# EAGLE design sensor_glove (EAGLE 8.1.1)
CNAME: SensorGlove Schematic; CREVISION: v1.0; DESIGNER: David González Filoso
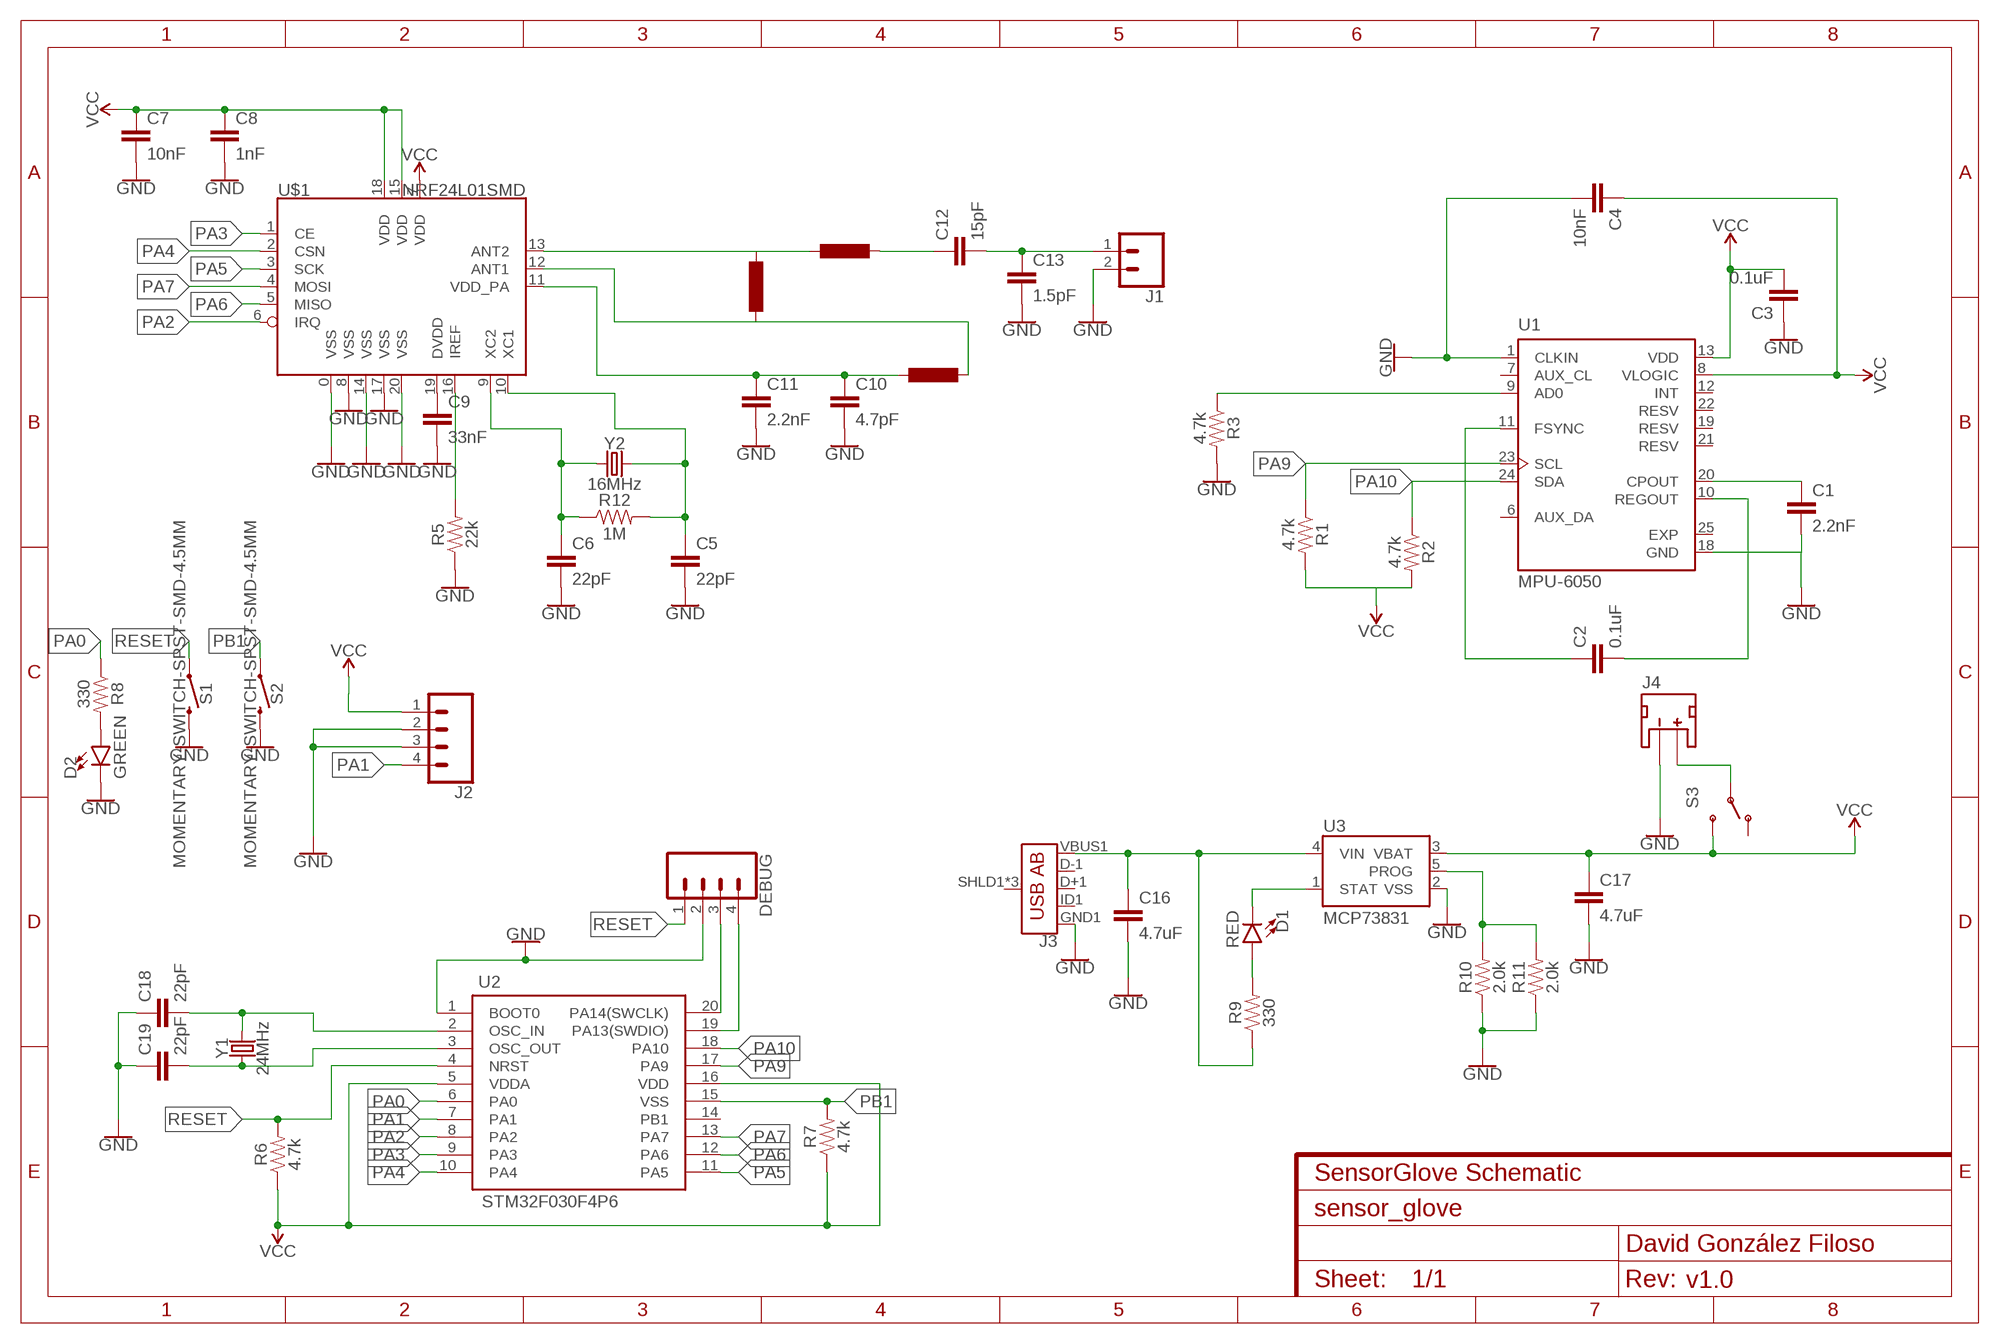
[diagram p0: schematic, sheet 1]

## Parts
C1  2.2nF  2.2NF/2200PF-0603-50V-10%  [0603]
C2  0.1uF  0.1UF-0402-16V-10%  [0402]
C3  0.1uF  0.1UF-0402-16V-10%  [0402]
C4  10nF  10NF-0603-50V-10%  [0603]
C5  22pF  22PF-0603-50V-5%  [0603]
C6  22pF  22PF-0603-50V-5%  [0603]
C7  10nF  10NF-0603-50V-10%  [0603]
C8  1nF  1.0NF/1000PF-0603-50V-10%  [0603]
C9  33nF  33NF-0603-50V-10%  [0603]
C10  4.7pF  4.7PF-0603-50V-5%  [0603]
C11  2.2nF  2.2NF/2200PF-0603-50V-10%  [0603]
C12  15pF  15PF-0402-50V-5%  [0402]
C13  1.5pF  1.5PF-0603-50V-16.667%  [0603]
C16  4.7uF  4.7UF0603  [0603]
C17  4.7uF  4.7UF0603  [0603]
C18  22pF  22PF-0603-50V-5%  [0603]
C19  22pF  22PF-0603-50V-5%  [0603]
D1  RED  LED-RED0603  [LED-0603]
D2  GREEN  LED-GREEN0603  [LED-0603]
DEBUG  CONN_04  [1X04]
J1  CONN_02  [1X02]
J2  CONN_04  [1X04]
J3  USB_AB_SMT  [USB-AB-MICRO-SMD]
J4  JST_2MM_MALE  [JST-2-SMD]
R1  4.7k  4.7KOHM-0603-1/10W-1%  [0603]
R2  4.7k  4.7KOHM-0603-1/10W-1%  [0603]
R3  4.7k  4.7KOHM-0603-1/10W-1%  [0603]
R5  22k  22KOHM-0603-1/10W-1%  [0603]
R6  4.7k  4.7KOHM-0603-1/10W-1%  [0603]
R7  4.7k  4.7KOHM-0603-1/10W-1%  [0603]
R8  330  330OHM-0603-1/10W-1%  [0603]
R9  330  330OHM-0603-1/10W-1%  [0603]
R10  2.0k  2.0KOHM-0603-1/10W-5%  [0603]
R11  2.0k  2.0KOHM-0603-1/10W-5%  [0603]
R12  1M  1MOHM-0603-1/4W-5%  [0603]
S1  MOMENTARY-SWITCH-SPST-SMD-4.5MM  [TACTILE_SWITCH_SMD_4.5MM]
S2  MOMENTARY-SWITCH-SPST-SMD-4.5MM  [TACTILE_SWITCH_SMD_4.5MM]
S3  SWITCH-SPDTSMD  [SWITCH_SPDT_SMD]
U1  MPU-6050  [QFN50P400X400X95-25N]
U2  STM32F030F4P6  [TSSOP20-STM32]
U3  MCP73831  [SOT23-5]
U$1  NRF24L01SMD  [QFN20-4X4MM]
Y1  24MHz  CRYSTAL-24MHZ"  [CRYSTAL-SMD-5X3.2-4PAD]
Y2  16MHz  CRYSTAL-16MHZPTH-HC49US  [HC49US]

## Nets
CON: J4.2(+) S3.2(P)
FSYNC: C2.1 U1.11(FSYNC)
GND: C3.1 C4.2 C5.2 C6.2 C7.2 C8.2 C9.2 C10.2 C11.2 C13.2 C16.2 C17.2 C18.1 C19.1 D2.C DEBUG.2 J1.2 J2.2 J2.3 J3.GND1(GND) J4.1(-) R3.2 R5.1 S1.1 S1.4 S2.1 S2.4 U1.1(CLKIN) U2.1(BOOT0) U$1.0(VSS) U$1.8(VSS) U$1.14(VSS) U$1.17(VSS) U$1.20(VSS)
N$1: R3.1 U1.9(AD0)
N$2: C16.1 J3.VBUS1(VBUS) R9.1 U3.4(VIN)
N$3: DEBUG.3 U2.20(PA14(SWCLK))
N$4: C6.1 R12.1 U$1.9(XC2) Y2.1
N$6: C1.1 U1.20(CPOUT)
N$7: C1.2 U1.18(GND)
N$8: C5.1 R12.2 U$1.10(XC1) Y2.2
N$9: C10.1 C11.1 U$1.11(VDD_PA)
N$10: C9.1 U$1.19(DVDD)
N$11: R5.2 U$1.16(IREF)
N$12: U$1.12(ANT1)
N$13: U$1.13(ANT2)
N$14: C12.1
N$15: C12.2 C13.1 J1.1
N$18: C18.2 U2.2(OSC_IN) Y1.3
N$19: C19.2 U2.3(OSC_OUT) Y1.1
N$20: DEBUG.4 U2.19(PA13(SWDIO))
N$22: D2.A R8.2
N$24: D1.C U3.1(STAT)
N$25: D1.A R9.2
N$27: R10.2 R11.2 U3.5(PROG)
N$28: R10.1 R11.1
N$29: U3.2(VSS)
PA0: R8.1 U2.6(PA0)
PA1: J2.4 U2.7(PA1)
PA2: U2.8(PA2) U$1.6(IRQ)
PA3: U2.9(PA3) U$1.1(CE)
PA4: U2.10(PA4) U$1.2(CSN)
PA5: U2.11(PA5) U$1.3(SCK)
PA6: U2.12(PA6) U$1.5(MISO)
PA7: U2.13(PA7) U$1.4(MOSI)
PA9: R1.1 U1.23(SCL) U2.17(PA9)
PA10: R2.1 U1.24(SDA) U2.18(PA10)
PB1: R7.2 S2.2 S2.3 U2.15(VSS)
REGOUT: C2.2 U1.10(REGOUT)
RESET: DEBUG.1 R6.2 S1.2 S1.3 U2.4(NRST)
VCC: C3.2 C4.1 C7.1 C8.1 C17.1 J2.1 R1.2 R2.2 R6.1 R7.1 S3.3(S) U1.8(VLOGIC) U1.13(VDD) U2.5(VDDA) U2.16(VDD) U3.3(VBAT) U$1.7(VDD) U$1.15(VDD) U$1.18(VDD)
Unconnected: J3.D+1(D+) J3.D-1(D-) J3.ID1(USBID) J3.SHLD1(SHIELD) J3.SHLD2(SHIELD) J3.SHLD3(SHIELD) J4.NC1(PAD1) J4.NC2(PAD2) S3.1(O) U1.6(AUX_DA) U1.7(AUX_CL) U1.12(INT) U1.19(RESV) U1.21(RESV) U1.22(RESV) U2.14(PB1)

## Power pins joined to a net without a drawn wire
EXP: U1.25(EXP)

## Library data of the parts
C1 C11 = SparkFun-Capacitors:2.2NF/2200PF: 2.2nF/2,200pF ceramic capacitors A capacitor is a passive two-terminal electrical component used to store electrical energy temporarily in an electric field.; PROD_ID: CAP-07877
C2 C3 = SparkFun-Capacitors:0.1UF: 0.1µF ceramic capacitors A capacitor is a passive two-terminal electrical component used to store electrical energy temporarily in an electric field.; PROD_ID: CAP-12416
C4 C7 = SparkFun-Capacitors:10NF: 0.01uF/10nF/10,000pF ceramic capacitors A capacitor is a passive two-terminal electrical component used to store electrical energy temporarily in an electric field. CAP-09321; PROD_ID: CAP-00867
C5 C6 C18 C19 = SparkFun-Capacitors:22PF: 22pF ceramic capacitors A capacitor is a passive two-terminal electrical component used to store electrical energy temporarily in an electric field.; PROD_ID: CAP-07876
C8 = SparkFun-Capacitors:1.0NF/1000PF: 1nF/1,000pF ceramic capacitors A capacitor is a passive two-terminal electrical component used to store electrical energy temporarily in an electric field.; PROD_ID: CAP-07886
C9 = SparkFun-Capacitors:33NF: 33nF ceramic capacitors A capacitor is a passive two-terminal electrical component used to store electrical energy temporarily in an electric field.; PROD_ID: CAP-07887
C10 = SparkFun-Capacitors:4.7PF: 4.7pF ceramic capacitors A capacitor is a passive two-terminal electrical component used to store electrical energy temporarily in an electric field.; PROD_ID: CAP-07880
C12 = SparkFun-Capacitors:15PF: 15pF ceramic capacitors A capacitor is a passive two-terminal electrical component used to store electrical energy temporarily in an electric field.; PROD_ID: CAP-13063
C13 = SparkFun-Capacitors:1.5PF: 1.5pF ceramic capacitors A capacitor is a passive two-terminal electrical component used to store electrical energy temporarily in an electric field.; PROD_ID: CAP-08763
C16 C17 = SparkFun-Capacitors:4.7UF: 4.7µF ceramic capacitors A capacitor is a passive two-terminal electrical component used to store electrical energy temporarily in an electric field.; PROD_ID: CAP-08280
D1 = SparkFun-LED:LED-RED: Red SMD LED Used in manufacturing of most products at SparkFun Packages: 0603 - SMD 0603 package [Product Link] <http://docs.avagotech.com/docs/AV02-0551EN> 0603 SMART - SMD 0603 SMART package ( more efficient and expensive)[Product Link] <http://www.osram-os.com/Graphics/XPic2/00077099_0.pdf> 1206 - SMD1206 package [Product Link] <https://www.sparkfun.com/datasheets/DevTools/LilyPad/Q150OVS4.pdff> SparkFun Products: Pro Mini 328 -5V <https://www.sparkfun.com/products/821> RedBoard <https://www.sparkfun.com/products/12757> IOIO-OTG <https://www.sparkfun.com/products/13613>; PROD_ID: DIO-00819
D2 = SparkFun-LED:LED-GREEN: Green SMD LED Used in manufacturing of various products at SparkFun Packages: 0603 - SMD 0603 package [Product Link] <http://www.futureelectronics.com/en/technologies/semiconductors/optoelectronics/leds/Pages/9894312-LTST-C190GKT.aspx?CrossPart=HSMG-C190&IM=0> LilyPad 1206 - SMD1206 LilyPad package [Product Link] <http://www.futureelectronics.com/en/Technologies/Product.aspx?ProductID=IN150NGHARVATEKCORPORATION2049943&IM=0> 1206 - SMD1206 package [Product Link] <http://www.futureelectronics.com/en/technologies/semiconductors/optoelectronics/leds/Pages/8315665-LTST-C150KGKT.aspx?IM=0> 1206 Bottom Mount -SMD 1206 Bottom Mount [Product Link] <http://www.digikey.com/product-detail/en/lite-on-inc/LTST-C230KGKT/160-1456-1-ND/386854> SparkFun Products: Pro Mini 328 -5V <https://www.sparkfun.com/products/821> RedBoard <https://www.sparkfun.com/products/12757> MP3 Trigger <https://www.sparkfun.com/products/13720> Makey Makey <https://www.sparkfun.com/products/11076>; PROD_ID: DIO-00821
DEBUG J2 = SparkFun-Connectors:CONN_04: Multi connection point. Often used as Generic Header-pin footprint for 0.1 inch spaced/style header connections On any of the 0.1 inch spaced packages, you can populate with these: Break Away Headers - Straight <https://www.sparkfun.com/products/116> (PRT-00116) Break Away Male Headers - Right Angle <https://www.sparkfun.com/products/553> (PRT-00553) Female Headers <https://www.sparkfun.com/products/115> (PRT-00115) Break Away Headers - Machine Pin <https://www.sparkfun.com/products/117> (PRT-00117) Break Away Female Headers - Swiss Machine Pin <https://www.sparkfun.com/products/743> (PRT-00743) For SCREWTERMINALS and SPRING TERMINALS visit here: Screw Terimnals on SparkFun.com <https://www.sparkfun.com/search/results?term=Screw+Terminals> (5mm/3.5mm/2.54mm spacing) This device is also useful as a general connection point to wire up your design to another part of your project. Our various solder wires solder well into these plated through hole pads. Hook-Up Wire - Assortment (Stranded, 22 AWG) <https://www.sparkfun.com/products/11375> (PRT-11375) Hook-Up Wire - Assortment (Solid Core, 22 AWG) <https://www.sparkfun.com/products/11367> (PRT-11367) View the entire wire category on our website here <https://www.sparkfun.com/categories/141> Special notes: Molex polarized connector foot print use with SKU : PRT-08231 with associated crimp pins and housings. 1MM SMD Version SKU: PRT-10208; PROD_ID: CONN-09696
J1 = SparkFun-Connectors:CONN_02: Multi connection point. Often used as Generic Header-pin footprint for 0.1 inch spaced/style header connections On any of the 0.1 inch spaced packages, you can populate with these: Break Away Headers - Straight <https://www.sparkfun.com/products/116> (PRT-00116) Break Away Male Headers - Right Angle <https://www.sparkfun.com/products/553> (PRT-00553) Female Headers <https://www.sparkfun.com/products/115> (PRT-00115) Break Away Headers - Machine Pin <https://www.sparkfun.com/products/117> (PRT-00117) Break Away Female Headers - Swiss Machine Pin <https://www.sparkfun.com/products/743> (PRT-00743) For SCREWTERMINALS and SPRING TERMINALS visit here: Screw Terimnals on SparkFun.com <https://www.sparkfun.com/search/results?term=Screw+Terminals> (5mm/3.5mm/2.54mm spacing) This device is also useful as a general connection point to wire up your design to another part of your project. Our various solder wires solder well into these plated through hole pads. Hook-Up Wire - Assortment (Stranded, 22 AWG) <https://www.sparkfun.com/products/11375> (PRT-11375) Hook-Up Wire - Assortment (Solid Core, 22 AWG) <https://www.sparkfun.com/products/11367> (PRT-11367) View the entire wire category on our website here <https://www.sparkfun.com/categories/141> Special notes: Molex polarized connector foot print use with: PRT-08233 with associated crimp pins and housings. 2.54_SCREWTERM for use with PRT-10571. 3.5mm Screw Terminal footprints for PRT-08084 5mm Screw Terminal footprints for use with PRT-08432
J3 = SparkFun-Connectors:USB_AB: USB Type AB Micro Connector OTG-compatible. 5 pins, 3 shield pins SparkFun Products: IOIO-OTG <https://www.sparkfun.com/products/13613> SparkFun SAMD21 Mini Breakout <https://www.sparkfun.com/products/13664>; PROD_ID: CONN-11794
J4 = SparkFun-Connectors:JST_2MM_MALE: JST 2MM MALE RA CONNECTOR Two pin, compact surface mount connector. Commonly used as a battery input connection point. We really like the solid locking feeling and high current rating on these small connectors. We use these all the time as battery connectors. Mates to single-cell LiPo batteries. Here is the connector we sell at SparkFun: JST Right Angle Connector - White <https://www.sparkfun.com/products/8612> (PRT-08612) Datasheet <http://www.sparkfun.com/datasheets/Prototyping/Connectors/JST-Horizontal.pdf> It was used on these SparkFun products: SparkFun MOSFET Power Controller <https://www.sparkfun.com/products/11214> (PRT-11214) SparkFun Battery Babysitter - LiPo Battery Manager <https://www.sparkfun.com/products/13777> (PRT-13777) And many, many others that required a lipo battery connection.; PROD_ID: CONN-11443; SF_ID: PRT-08612
R1-R3 R6 R7 = SparkFun-Resistors:4.7KOHM: 4.7kΩ resistor A resistor is a passive two-terminal electrical component that implements electrical resistance as a circuit element. Resistors act to reduce current flow, and, at the same time, act to lower voltage levels within circuits. - Wikipedia; PROD_ID: RES-07857
R5 = SparkFun-Resistors:22KOHM: 22kΩ resistor A resistor is a passive two-terminal electrical component that implements electrical resistance as a circuit element. Resistors act to reduce current flow, and, at the same time, act to lower voltage levels within circuits. - Wikipedia; PROD_ID: RES-07853
R8 R9 = SparkFun-Resistors:330OHM: 330Ω resistor A resistor is a passive two-terminal electrical component that implements electrical resistance as a circuit element. Resistors act to reduce current flow, and, at the same time, act to lower voltage levels within circuits. - Wikipedia; PROD_ID: RES-00818
R10 R11 = SparkFun-Resistors:2.0KOHM: 2kΩ resistor A resistor is a passive two-terminal electrical component that implements electrical resistance as a circuit element. Resistors act to reduce current flow, and, at the same time, act to lower voltage levels within circuits. - Wikipedia; PROD_ID: RES-08296
R12 = SparkFun-Resistors:1MOHM: 1MΩ resistor A resistor is a passive two-terminal electrical component that implements electrical resistance as a circuit element. Resistors act to reduce current flow, and, at the same time, act to lower voltage levels within circuits. - Wikipedia; PROD_ID: RES-07868
S1 S2 = SparkFun-Switches:MOMENTARY-SWITCH-SPST: Momentary Switch (Pushbutton) - SPST Normally-open (NO) SPST momentary switches (buttons, pushbuttons). Variants PTH-12MM - 12mm square, through-hole Momentary Pushbutton Switch - 12mm Square <https://www.sparkfun.com/products/9190> (COM-09190) PTH-6.0MM, PTH-6.0MM-KIT - 6.0mm square, through-hole Mini Pushbutton Switch <https://www.sparkfun.com/products/97> (COM-00097) KIT package intended for soldering kit's - only one side of pads' copper is exposed. PTH-RIGHT-ANGLE-KIT - Right-angle, through-hole Right Angle Tactile Button <https://www.sparkfun.com/products/10791> - Used on SparkFun BigTime Watch Kit <https://www.sparkfun.com/products/11734> SMD-12MM - 12mm square, surface-mount Tactile Button - SMD (12mm) <https://www.sparkfun.com/products/12993> (COM-12993) Used on SparkFun PicoBoard <https://www.sparkfun.com/products/11888> SMD-4.5MM - 4.5mm Square Trackball Switch Used on SparkFun Blackberry Trackballer Breakout <https://www.sparkfun.com/products/13169> SMD-4.6MMX2.8MM - 4.60mm x 2.80mm, surface mount Used on SparkFun SAMD21 Mini Breakout <https://www.sparkfun.com/products/13664> SMD-5.2MM, SMD-5.2-REDUNDANT - 5.2mm square, surface-mount Mini Pushbutton Switch - SMD <https://www.sparkfun.com/products/8720> (COM-08720) Used on Arduino Pro Mini <https://www.sparkfun.com/products/11114> REDUNDANT package connects both switch circuits together SMD-6.0X3.5MM - 6.0 x 3.5mm, surface mount Momentary Reset Switch SMD <https://www.sparkfun.com/products/8229> (COM-08229) SMD-6.2MM-TALL - 6.2mm square, surface mount Tactile Button - SMD (6mm) <https://www.sparkfun.com/products/12992> Used on SparkFun Digital Sandbox <https://www.sparkfun.com/products/12651> SMD-RIGHT-ANGLE - Right-angle, surface mount Used on SparkFun Block for Intel® Edison - Arduino <https://www.sparkfun.com/products/13036>; PROD_ID: SWCH-09213
S3 = SparkFun-Retired:SWITCH-SPDT: SPDT Switch Simple slide switch, Spark Fun Electronics SKU : COM-00102 DPDT SMT slide switch, AYZ0202, SWCH-08179
U1 = MPU-6050:MPU-6050: MPU-6050 Six-Axis (Gyro + Accelerometer) MEMS MotionTracking™ Devices; AVAILABILITY: Good; DESCRIPTION: 3-axis gyroscope, 3-axis accelerometer in a 4x4x0.9 housing; MF: InvenSense; MP: MPU-6050; PACKAGE: QFN-24 InvenSense; PRICE: 7.56 USD
U2 = STM32:STM32F030F4P6: Device for STM32F030F4P6
U3 = SparkFun-IC-Power:MCP73831: MCP73831T Li-Ion, Li-Pol Controller Miniature single cell, fully integrated Li-Ion, Li-polymer charge management controller Datasheet <http://ww1.microchip.com/downloads/en/DeviceDoc/20001984g.pdf> SparkFun Products: SparkFun ESP32 Thing <https://www.sparkfun.com/products/13907> SparkFun 9DoF Razor IMU M0 <https://www.sparkfun.com/products/14001>; PROD_ID: IC-09995
U$1 = SparkFun-RF:NRF24L01: Nordic nrf24L01 2.4GHz Low-power Transceiver This is the very popular, low cost, very low power RF transceiver from Nordic Semiconductor. Simple SPI interface. SparkFun Products 2.4GHz Transceiver IC - nRF24L01+ <https://www.sparkfun.com/products/690> (COM-00690) SparkFun Transceiver Breakout - nRF24L01+ (RP-SMA) <https://www.sparkfun.com/products/705> (WRL-00705) SparkFun Transceiver Breakout - nRF24L01+ <https://www.sparkfun.com/products/691> (COM-00691); PROD_ID: IC-08950; SF_ID: COM-00690
Y1 = SparkFun-Clocks:CRYSTAL-24MHZ: 24MHz Crystal Datasheet <http://www.sparkfun.com/datasheets/Components/AT-SMD-5x3.pdf> Frequency: 24MHz Frequency Tolerance: ±20ppm Load Capacitance: 12pF SparkFun Products: USB Bit Whacker <https://www.sparkfun.com/products/762>; PROD_ID: XTAL-08298; SF_ID: COM-08581
Y2 = SparkFun-Clocks:CRYSTAL-16MHZ: 16MHz Crystal Digikey Example <http://www.digikey.com/product-search/en?keywords=535-9122-1-ND> Frequency: 16MHz Frequency Stability: ±50ppm Frequency Tolerance: ±20ppm Load Capacitance: 18pF SparkFun Products: Pro Micro -5V/16MHz <https://www.sparkfun.com/products/12640> SparkFun Serial Enabled LCD Kit <https://www.sparkfun.com/products/10097>; PROD_ID: XTAL-08181; SF_ID: COM-00536

## Board
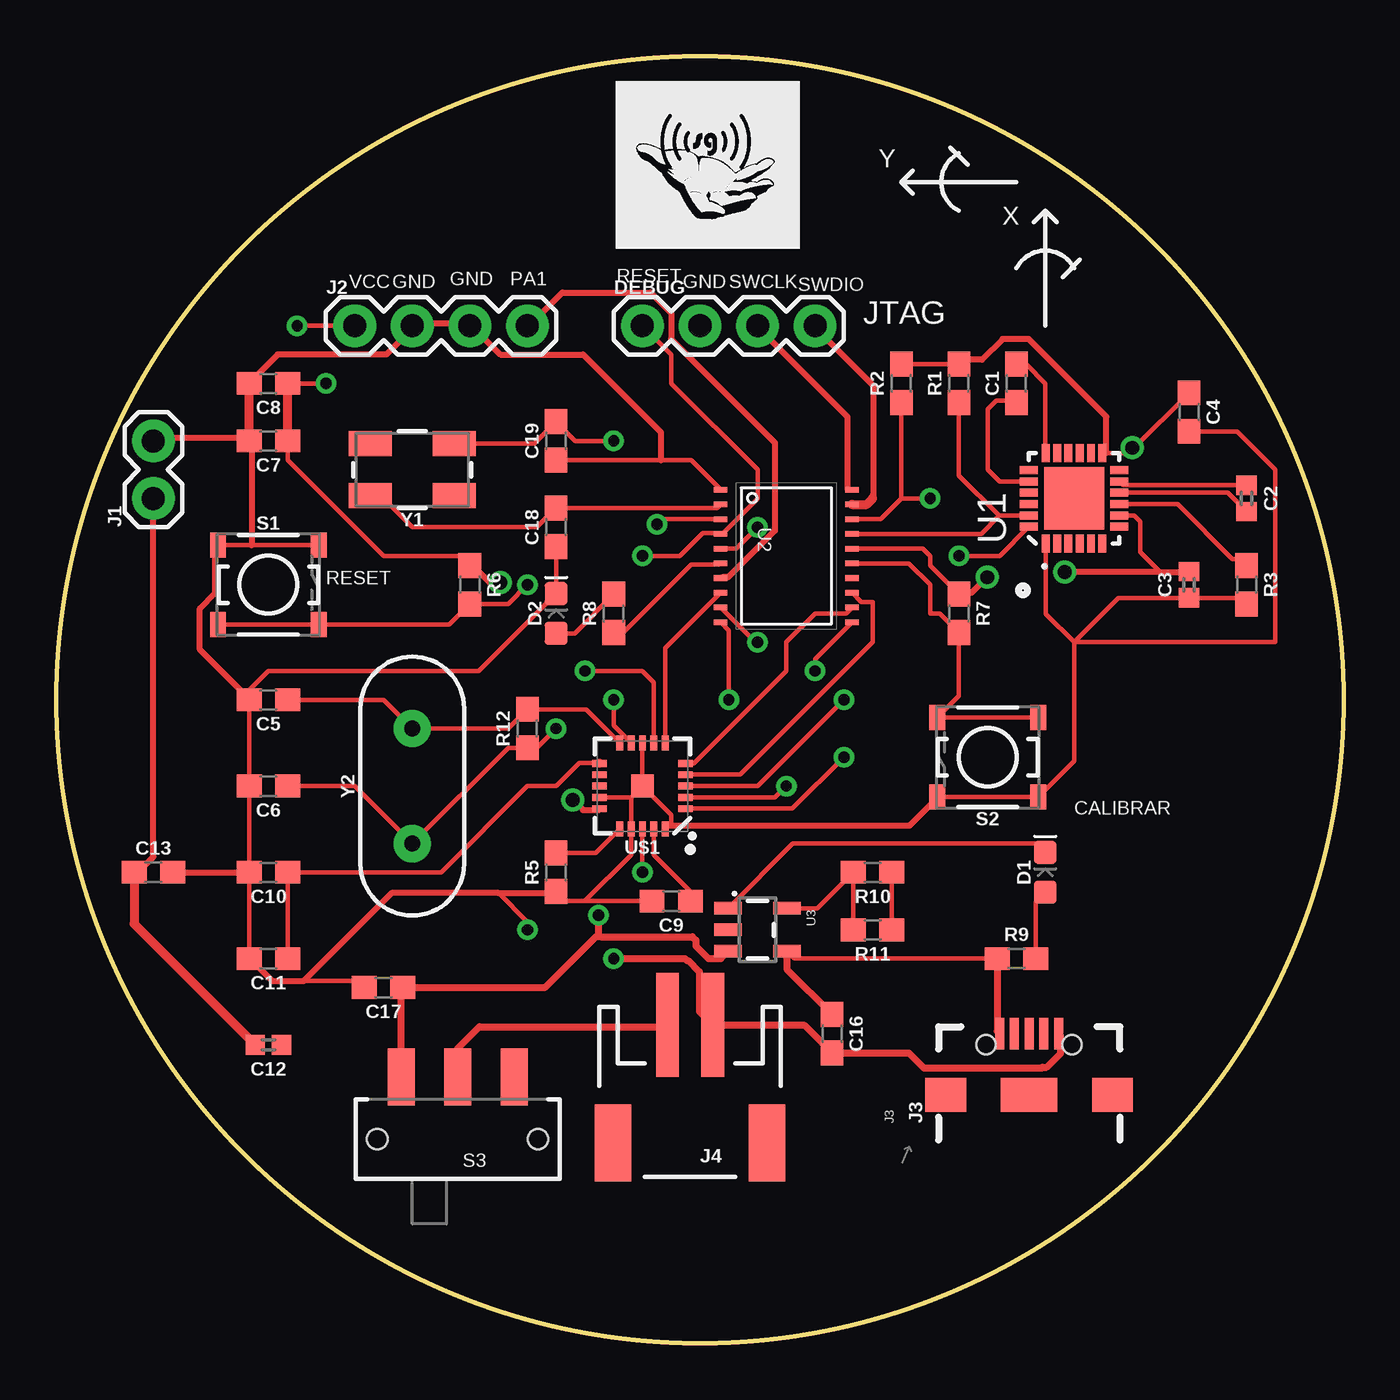
[diagram p1: board, top side]
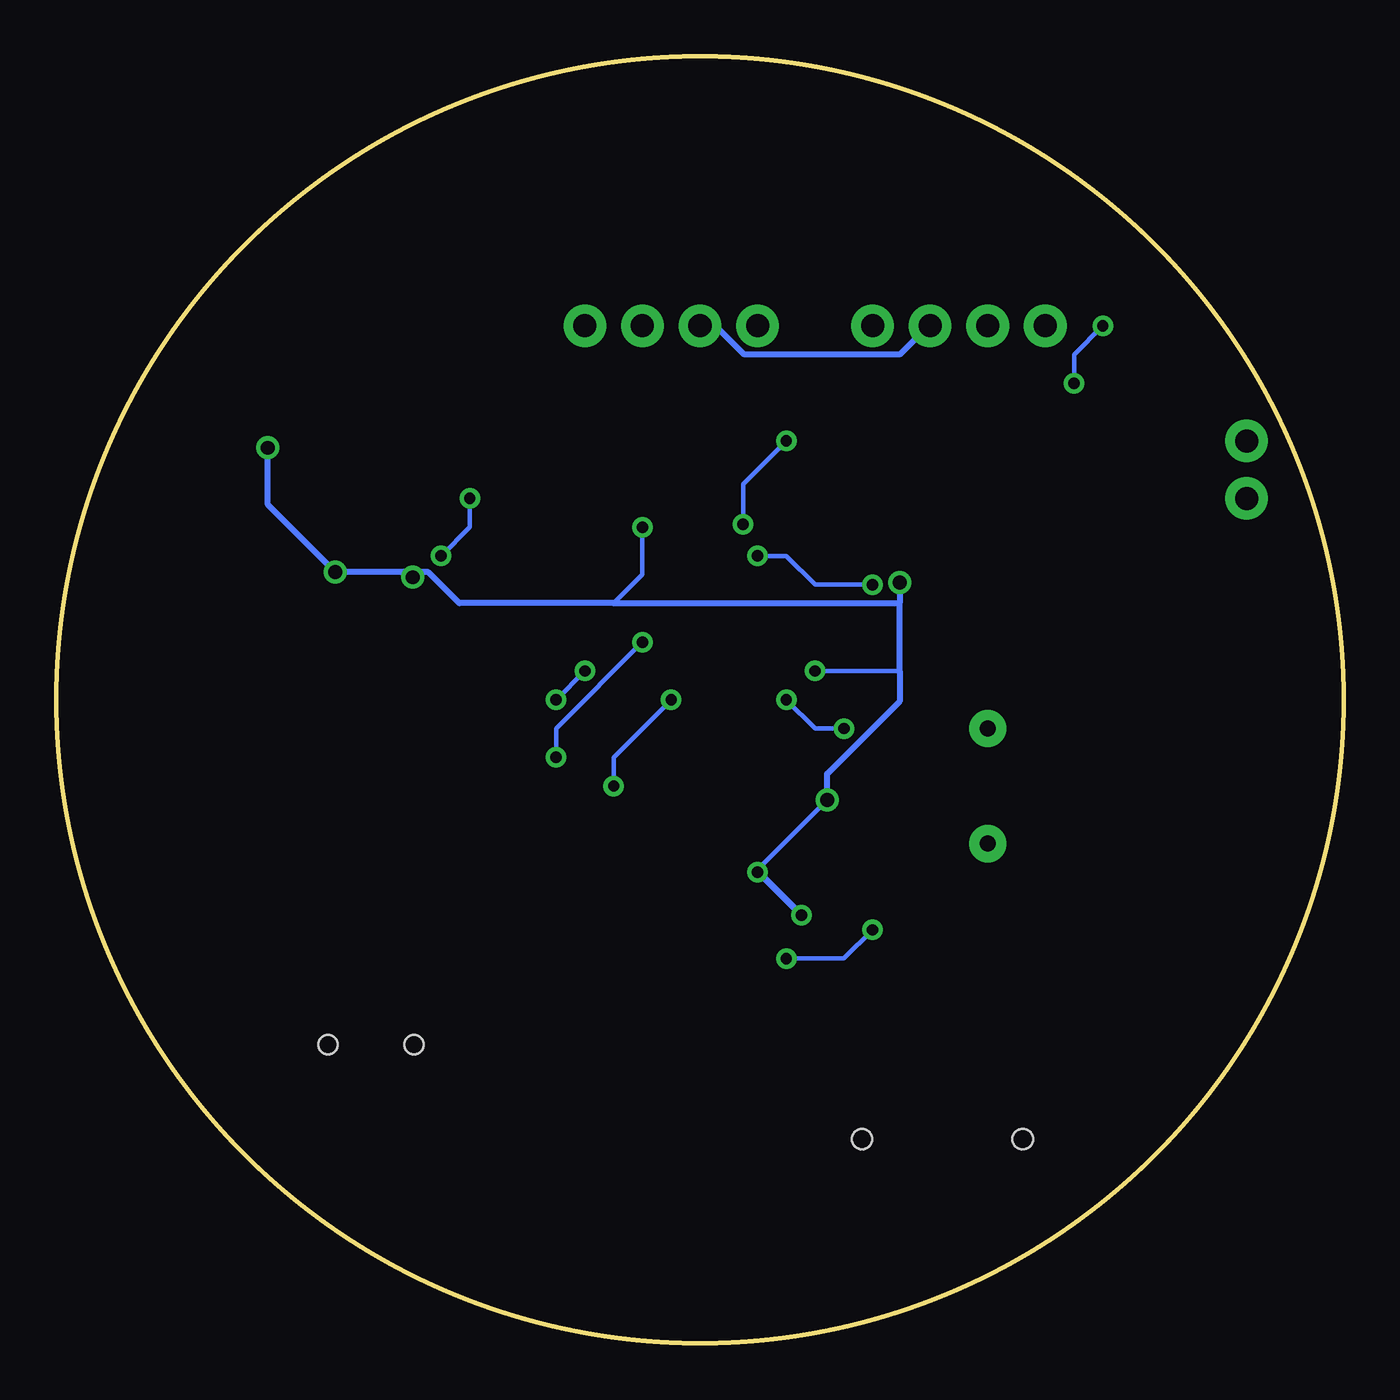
[diagram p2: board, bottom side, seen from below]

Size 56.8 x 56.8 mm. Coordinates in mm from the lower left corner, seen from the top.
Outline: circle at 28.4,28.4 radius 28.4
Copper layers (1*16): Top 0.035mm / dielectric 1.5mm / Bottom 0.035mm
Design rules "default": minimum track width 10mil, minimum drill 24mil, track to track 8mil, track to pad 8mil, pad to pad 8mil, via to via 8mil, smd to smd 8mil, copper to edge 40mil, drill to drill 8mil, minimum pad ring 10mil, minimum via ring 8mil, stop-mask expansion 4mil, vias tented up to drill 0mil, thermal gap 10mil

### Footprints (pad centres in the part's own frame; a part is rotated, then mirrored left to right if it is on the bottom)
0603 = smd 1.1 x 1: 1 -0.85,0; 2 0.85,0
0402 = smd 0.85 x 0.9: 1 -0.58,0; 2 0.58,0
LED-0603 = smd 1 x 1: A -0.877,0; C 0.877,0
1X04 = drill 1.016 pad 1.88: 1 0,0; 2 2.54,0; 3 5.08,0; 4 7.62,0
1X02 = drill 1.016 pad 1.88: 1 0,0; 2 2.54,0
USB-AB-MICRO-SMD = smd 1.4 x 0.4: D+1 2.7,0; D-1 2.7,0.65; GND1 2.7,-1.3; ID1 2.7,-0.65; VBUS1 2.7,1.3 | smd 1.5 x 1.8: SHLD1 0,-3.68; SHLD2 0,3.68 | smd 1.5 x 2.5: SHLD3 0,0 | hole 0.85: 2.2,1.9; 2.2,-1.9
JST-2-SMD = smd 1 x 4.6: 1 -1,-3.7; 2 1,-3.7 | smd 1.6 x 3.4: NC1 -3.4,1.5; NC2 3.4,1.5
TACTILE_SWITCH_SMD_4.5MM = smd 0.7 x 1.1: 1 2.225,1.75; 2 2.225,-1.75; 3 -2.225,-1.75; 4 -2.225,1.75
SWITCH_SPDT_SMD = smd 1.2 x 2.5: 1 -2.5,-2.75; 2 0,-2.75; 3 2.5,-2.75 | hole 0.9: -3.55,0; 3.55,0
QFN50P400X400X95-25N = smd 0.8 x 0.35: 1 -2,1.25; 2 -2,0.75; 3 -2,0.25; 4 -2,-0.25; 5 -2,-0.75; 6 -2,-1.25; 13 2,-1.25; 14 2,-0.75; 15 2,-0.25; 16 2,0.25; 17 2,0.75; 18 2,1.25 | smd 0.35 x 0.8: 7 -1.25,-2; 8 -0.75,-2; 9 -0.25,-2; 10 0.25,-2; 11 0.75,-2; 12 1.25,-2; 19 1.25,2; 20 0.75,2; 21 0.25,2; 22 -0.25,2; 23 -0.75,2; 24 -1.25,2 | smd 2.75 x 2.65: 25 0,0
TSSOP20-STM32 = smd 0.6 x 0.245: 1 -2.9,2.925; 2 -2.9,2.275; 3 -2.9,1.625; 4 -2.9,0.975; 5 -2.9,0.325; 6 -2.9,-0.325; 7 -2.9,-0.975; 8 -2.9,-1.625; 9 -2.9,-2.275; 10 -2.9,-2.925; 11 2.9,-2.925; 12 2.9,-2.275; 13 2.9,-1.625; 14 2.9,-0.975; 15 2.9,-0.325; 16 2.9,0.325; 17 2.9,0.975; 18 2.9,1.625; 19 2.9,2.275; 20 2.9,2.925
SOT23-5 = smd 0.55 x 1.2: 1 -0.95,-1.3; 2 0,-1.3; 3 0.95,-1.3; 4 0.95,1.3; 5 -0.95,1.3
QFN20-4X4MM = smd 1 x 1: 0 0,0 | smd 0.65 x 0.3: 1 -1.9,1; 2 -1.9,0.5; 3 -1.9,0; 4 -1.9,-0.5; 5 -1.9,-1; 11 1.9,-1; 12 1.9,-0.5; 13 1.9,0; 14 1.9,0.5; 15 1.9,1 | smd 0.3 x 0.65: 6 -1,-1.9; 7 -0.5,-1.9; 8 0,-1.9; 9 0.5,-1.9; 10 1,-1.9; 16 1,1.9; 17 0.5,1.9; 18 0,1.9; 19 -0.5,1.9; 20 -1,1.9
CRYSTAL-SMD-5X3.2-4PAD = smd 1.9 x 1.1: 1 -1.85,-1.15; 2 1.85,-1.15; 3 1.85,1.15; 4 -1.85,1.15
HC49US = drill 0.7 pad 1.651: 1 -2.54,0; 2 2.54,0

### Placement (x,y rotation side)
C1  42.37,42.37 90 top
C2  52.53,37.29 270 top
C3  49.99,33.48 90 top
C4  49.99,41.1 270 top
C5  9.35,28.4 180 top
C6  9.35,24.59 180 top
C7  9.35,39.83 180 top
C8  9.35,42.37 180 top
C9  27.13,19.51 180 top
C10  9.35,20.78 180 top
C11  9.35,16.97 180 top
C12  9.35,13.16 180 top
C13  4.27,20.78 0 top
C16  34.23,13.65 270 top
C17  14.43,15.7 180 top
C18  22.05,36.02 90 top
C19  22.05,39.83 90 top
D1  43.64,20.78 90 top
D2  22.05,32.21 90 top
DEBUG  25.86,44.91 0 top
J1  4.27,37.29 90 top
J2  13.16,44.91 0 top
J3  42.93,10.96 90 top
J4  27.96,10.34 180 top
R1  39.83,42.37 90 top
R2  37.29,42.37 90 top
R3  52.53,33.48 270 top
R5  22.05,20.78 90 top
R6  18.24,33.48 270 top
R7  39.83,32.21 270 top
R8  24.59,32.21 90 top
R9  42.37,16.97 0 top
R10  36.02,20.78 180 top
R11  36.02,18.24 180 top
R12  20.78,27.13 90 top
S1  9.35,33.48 0 top
S2  41.1,25.86 180 top
S3  17.7,9 180 top
U1  44.91,37.29 90 top
U2  32.21,34.75 0 top
U3  30.94,18.24 270 top
U$1  25.86,24.59 180 top
Y1  15.7,38.56 180 top
Y2  15.7,24.59 90 top

### Tracks (layer width: path | path; a pad name or v marks a point on that pad's centre or on a via)
CON
  Top 0.305: S3.2 17.71,13 18.66,13.96 26.88,13.96 J4.2
  Top 0.406: 17.86,11.75 S3.2
FSYNC
  Top 0.203: C2.1 47.08,37.87 U1.11
GND  (via drill 0.5)
  Top 0.203: R3.2 52.26,32.9 C3.1 46.87,32.9 44.91,30.94 | U1.1 43.66,32.19 44.91,30.94 | 44.91,30.94 44.91,25.69 S2.4 S2.1 | C4.2 52.11,40.25 53.8,38.56 53.8,30.94 44.91,30.94 | v20.78,18.24 20.78,18.59 19.51,19.86 | 10.9,15.98 13.3,15.98 C17.2 | C11.2 C10.2 C6.2 C5.2 8.5,28.82 9.35,29.67 18.63,29.67 D2.C C18.1 | U$1.0 U$1.8 | U$1.0 27.13,23.32 27.13,22.96 U$1.20 | 25.36,24.09 U$1.0 | U$1.14 25.36,24.09 | 25.36,24.09 U$1.17 25.36,21.55 23.32,19.51 | 23.32,19.51 C9.2 | 23.32,19.51 22.47,19.51 R5.1 | S1.4 8.61,35.23 S1.1 | C19.1 26.67,38.98 28,38.98 U2.1
  Top 0.254: J1.2 4.27,39.98 8.38,39.98 C7.2 8.61,39.75 8.61,35.23 | 26.67,38.98 26.67,40.21 23.24,43.64 19.58,43.64 18.44,44.78 J2.3 18.21,45.01 15.7,45.01 J2.2 15.7,44.78 14.56,43.64 9.75,43.64 8.61,42.5 C8.2 | U$1.20 26.9,22.84 37.64,22.84 38.79,23.98 S2.1 | C13.2 C10.2 | D2.C 21.87,32.89 | 8.61,28.55 C5.2 8.38,28.55 6.33,30.61 6.33,32.44 7.01,33.12 7.01,35.18 S1.4 | R5.1 21.87,19.86 19.51,19.86 14.78,19.86 10.9,15.98 9.53,15.98 8.61,16.89 C11.2
  Top 0.305: v24.59,16.97 27.73,16.97 27.81,16.88 27.88,16.88 28.37,16.39 28.37,14.63 J4.1 32.99,14.04 C16.2 37.62,12.8 38.28,12.14 43.49,12.14 43.52,12.17 43.7,12.17 44.32,12.78 44.32,13.57 J3.GND1
  Top 0.406: C7.2 C8.2
  Bottom 0.203: v24.59,16.97 22.05,16.97 v20.78,18.24
  Bottom 0.254: DEBUG.2 28.27,44.78 27.59,44.78 26.44,43.64 19.58,43.64 18.44,44.78 J2.3
N$1
  Top 0.203: U1.9 49.48,37.04 51.89,34.62 52.24,34.62 R3.1
N$2
  Top 0.203: R9.1 32.56,16.97 U3.4
  Top 0.305: U3.4 32.24,16.49 C16.1 | R9.1 41.52,13.77 J3.VBUS1
  Top 0.406: 32.24,17.07 U3.4
N$3
  Top 0.254: U2.20 34.9,37.69 34.9,40.9 31.01,44.78 DEBUG.3
N$4  (via drill 0.5)
  Top 0.203: C6.1 13.16,24.59 Y2.1 19.93,26.28 R12.1 21.2,26.28 v22.05,27.13 | v24.59,28.4 24.59,27.26 U$1.9
  Bottom 0.203: v22.05,27.13 23.32,27.13 v24.59,28.4
N$6
  Top 0.203: U1.20 41.62,38.04 41.1,38.56 41.1,41.23 41.48,41.61 42.28,41.61 C1.1
N$7
  Top 0.203: C1.2 42.79,43.22 43.64,42.37 43.64,39.31 U1.18
N$8
  Top 0.203: U$1.10 23.37,27.98 R12.2 19.93,27.13 Y2.2 14.43,28.4 C5.1
N$9
  Top 0.203: C11.1 C10.1 16.97,20.78 20.78,24.59 22.05,24.59 23.06,25.6 23.94,25.6 U$1.11
  Top 0.406: U$1.11 23.94,25.6
N$10
  Top 0.203: C9.1 27.98,19.93 26.37,21.54 U$1.19
N$11
  Top 0.203: R5.2 23.8,21.63 U$1.16
N$15
  Top 0.254: J1.1 4.27,21.46 3.58,20.78 C13.1
  Top 0.406: C13.1 3.42,18.51 C12.2
N$18
  Top 0.203: U2.2 29.15,36.87 C18.2 21.2,36.02 15.7,36.02 14.31,37.41 Y1.3
N$19  (via drill 0.5)
  Top 0.203: U2.3 26.72,36.37 v26.49,36.15 | v24.59,39.83 22.9,39.83 C19.2 21.08,39.71 Y1.1
  Bottom 0.203: v26.49,36.15 26.49,37.92 v24.59,39.83
N$20
  Top 0.254: 36.02,37.29 36.04,37.47 36.04,42.27 33.53,44.78 DEBUG.4
  Top 0.406: U2.19 35.75,37.02 36.02,37.29
N$22
  Top 0.203: D2.A 22.86,31.33 R8.2
N$24
  Top 0.203: D1.C 43.25,22.05 32.5,22.05 U3.1
N$25
  Top 0.203: R9.2 43.22,19.48 D1.A
N$27
  Top 0.203: U3.5 33.58,19.19 R10.2 R11.2
N$28
  Top 0.203: R10.1 R11.1
PA0
  Top 0.203: R8.1 25.01,31.36 28.02,34.37 29.25,34.37 U2.6
PA1
  Top 0.254: U2.7 29.41,33.81 29.64,33.81 31.7,35.87 31.7,39.75 27.13,44.32 27.13,45.47 26.21,46.38 22.33,46.38 20.96,45.01 J2.4
PA2
  Top 0.203: U$1.6 26.86,30.67 U2.8
PA3  (via drill 0.5)
  Top 0.203: U$1.1 32.48,23.59 v34.75,25.86 | v30.94,30.94 30.84,30.94 U2.9
  Bottom 0.203: v34.75,25.86 34.75,27.13 v30.94,30.94
PA4  (via drill 0.5)
  Top 0.203: U$1.2 31.71,24.09 v32.21,24.59 | v29.67,28.4 29.67,31.46 U2.10
  Bottom 0.203: v32.21,24.59 32.21,25.86 v29.67,28.4
PA5  (via drill 0.5)
  Top 0.203: U$1.3 30.94,24.59 v34.75,28.4 | v33.48,29.67 33.48,30.19 U2.11
  Bottom 0.203: v34.75,28.4 v33.48,29.67
PA6
  Top 0.203: U$1.5 28.13,25.59 32.21,29.67 32.21,30.94 33.48,32.21 34.84,32.21 U2.12
PA7
  Top 0.203: U$1.4 30.17,25.09 36.02,30.94 36.02,32.72 35.52,32.72 U2.13
PA9
  Top 0.203: U2.17 40.8,35.72 41.61,36.53 | 41.61,36.53 42.9,36.53 U1.23 | 41.61,36.53 39.83,38.3 R1.1
PA10  (via drill 0.5)
  Top 0.203: U2.18 36.37,36.37 37.29,37.29 | 37.29,37.29 R2.1 | 37.29,37.29 v38.56,37.29 | U1.24 41.62,34.75 v39.83,34.75
  Bottom 0.203: v38.56,37.29 38.56,36.02 v39.83,34.75
PB1
  Top 0.203: U2.15 37.61,34.42 38.56,33.48 38.56,32.21 38.98,32.21 R7.2 39.83,28.56 S2.2 S2.3
REGOUT
  Top 0.203: U1.10 51.7,37.54 C2.2
RESET  (via drill 0.5)
  Top 0.203: S1.3 S1.2 17.34,31.73 R6.2 19.93,32.63 v20.78,33.48 | v25.86,34.75 27.51,34.75 28.53,35.76 29.27,35.76 U2.4 | 29.37,35.72 U2.4 | DEBUG.1 27.13,43.64 27.13,42.37 30.94,38.56 30.94,37.29 29.37,35.72 | U2.4 29.37,35.72
  Bottom 0.203: v20.78,33.48 23.32,33.48 24.59,34.75 v25.86,34.75
VCC  (via drill 0.5, 0.61)
  Top 0.203: R2.2 R1.2 | U2.16 38.23,35.07 38.56,34.75 38.56,34.33 R7.1 | U1.13 47.33,39.29 47.52,39.48 C4.1 | U2.5 29.99,35.07 v30.94,36.02 | U$1.7 26.36,29.17 25.86,29.67 v23.32,29.67 | U$1.18 v25.86,20.78 | U1.8 47.56,36.54 47.83,36.27 47.83,34.93 48.72,34.04 | C7.1 10.2,38.98 14.43,34.75 17.82,34.75 R6.1 | C8.1 v11.89,42.37 | v10.62,44.91 J2.1
  Top 0.254: R1.2 39.93,43.41 40.84,43.41 41.76,44.32 42.9,44.32 46.33,40.9 46.33,39.3 U1.13 | v22.79,23.98 23.24,23.52 23.93,23.52 U$1.15 | v19.58,33.58 19.13,33.58 18.44,34.27 R6.1 | v44.5,34.04 48.72,34.04 49.99,34.04 C3.2 | v41.07,33.81 40.39,33.12 39.93,33.12 R7.1 | v47.47,39.52 47.52,39.48
  Top 0.305: S3.3 15.21,15.63 C17.1 21.58,15.7 23.81,17.93 24.02,17.93 | 24.02,17.93 28.06,17.93 28.21,17.77 28.21,17.53 28.77,16.97 29.32,16.97 U3.3 | v23.92,18.88 23.92,18.03 24.02,17.93
  Top 0.406: C7.1 C8.1
  Bottom 0.203: v30.94,36.02 30.94,33.94 32.21,32.67 | v23.32,29.67 19.58,29.67 | v25.86,20.78 25.86,20.91 v22.79,23.98 | v11.89,42.37 11.89,43.64 v10.62,44.91
  Bottom 0.254: v22.79,23.98 22.79,25.12 19.58,28.32 19.58,29.67 19.58,32.67 | v19.58,33.58 19.58,32.67 | 41.07,34.04 40.39,34.04 39.02,32.67 32.21,32.67 19.58,32.67 | 41.07,34.04 v44.5,34.04 47.47,37.01 v47.47,39.52 | 41.07,34.04 v41.07,33.81
  Bottom 0.305: v25.86,20.78 25.81,20.78 v23.92,18.88

### Text on the board
tPlace: Y | JTAG | X | C:/Users/David/Google Drive/Teleco/2016-2017/2º Semestre/ELCO/Logo/photo_2017-05-09_11-54-50.bmp | JTAG | VCC | GND | GND | PA1 | RESET | GND | SWCLK | SWDIO | JTAG | RESET | CALIBRAR